# Altium project EMG_MainBoard_Layout.PrjPcb
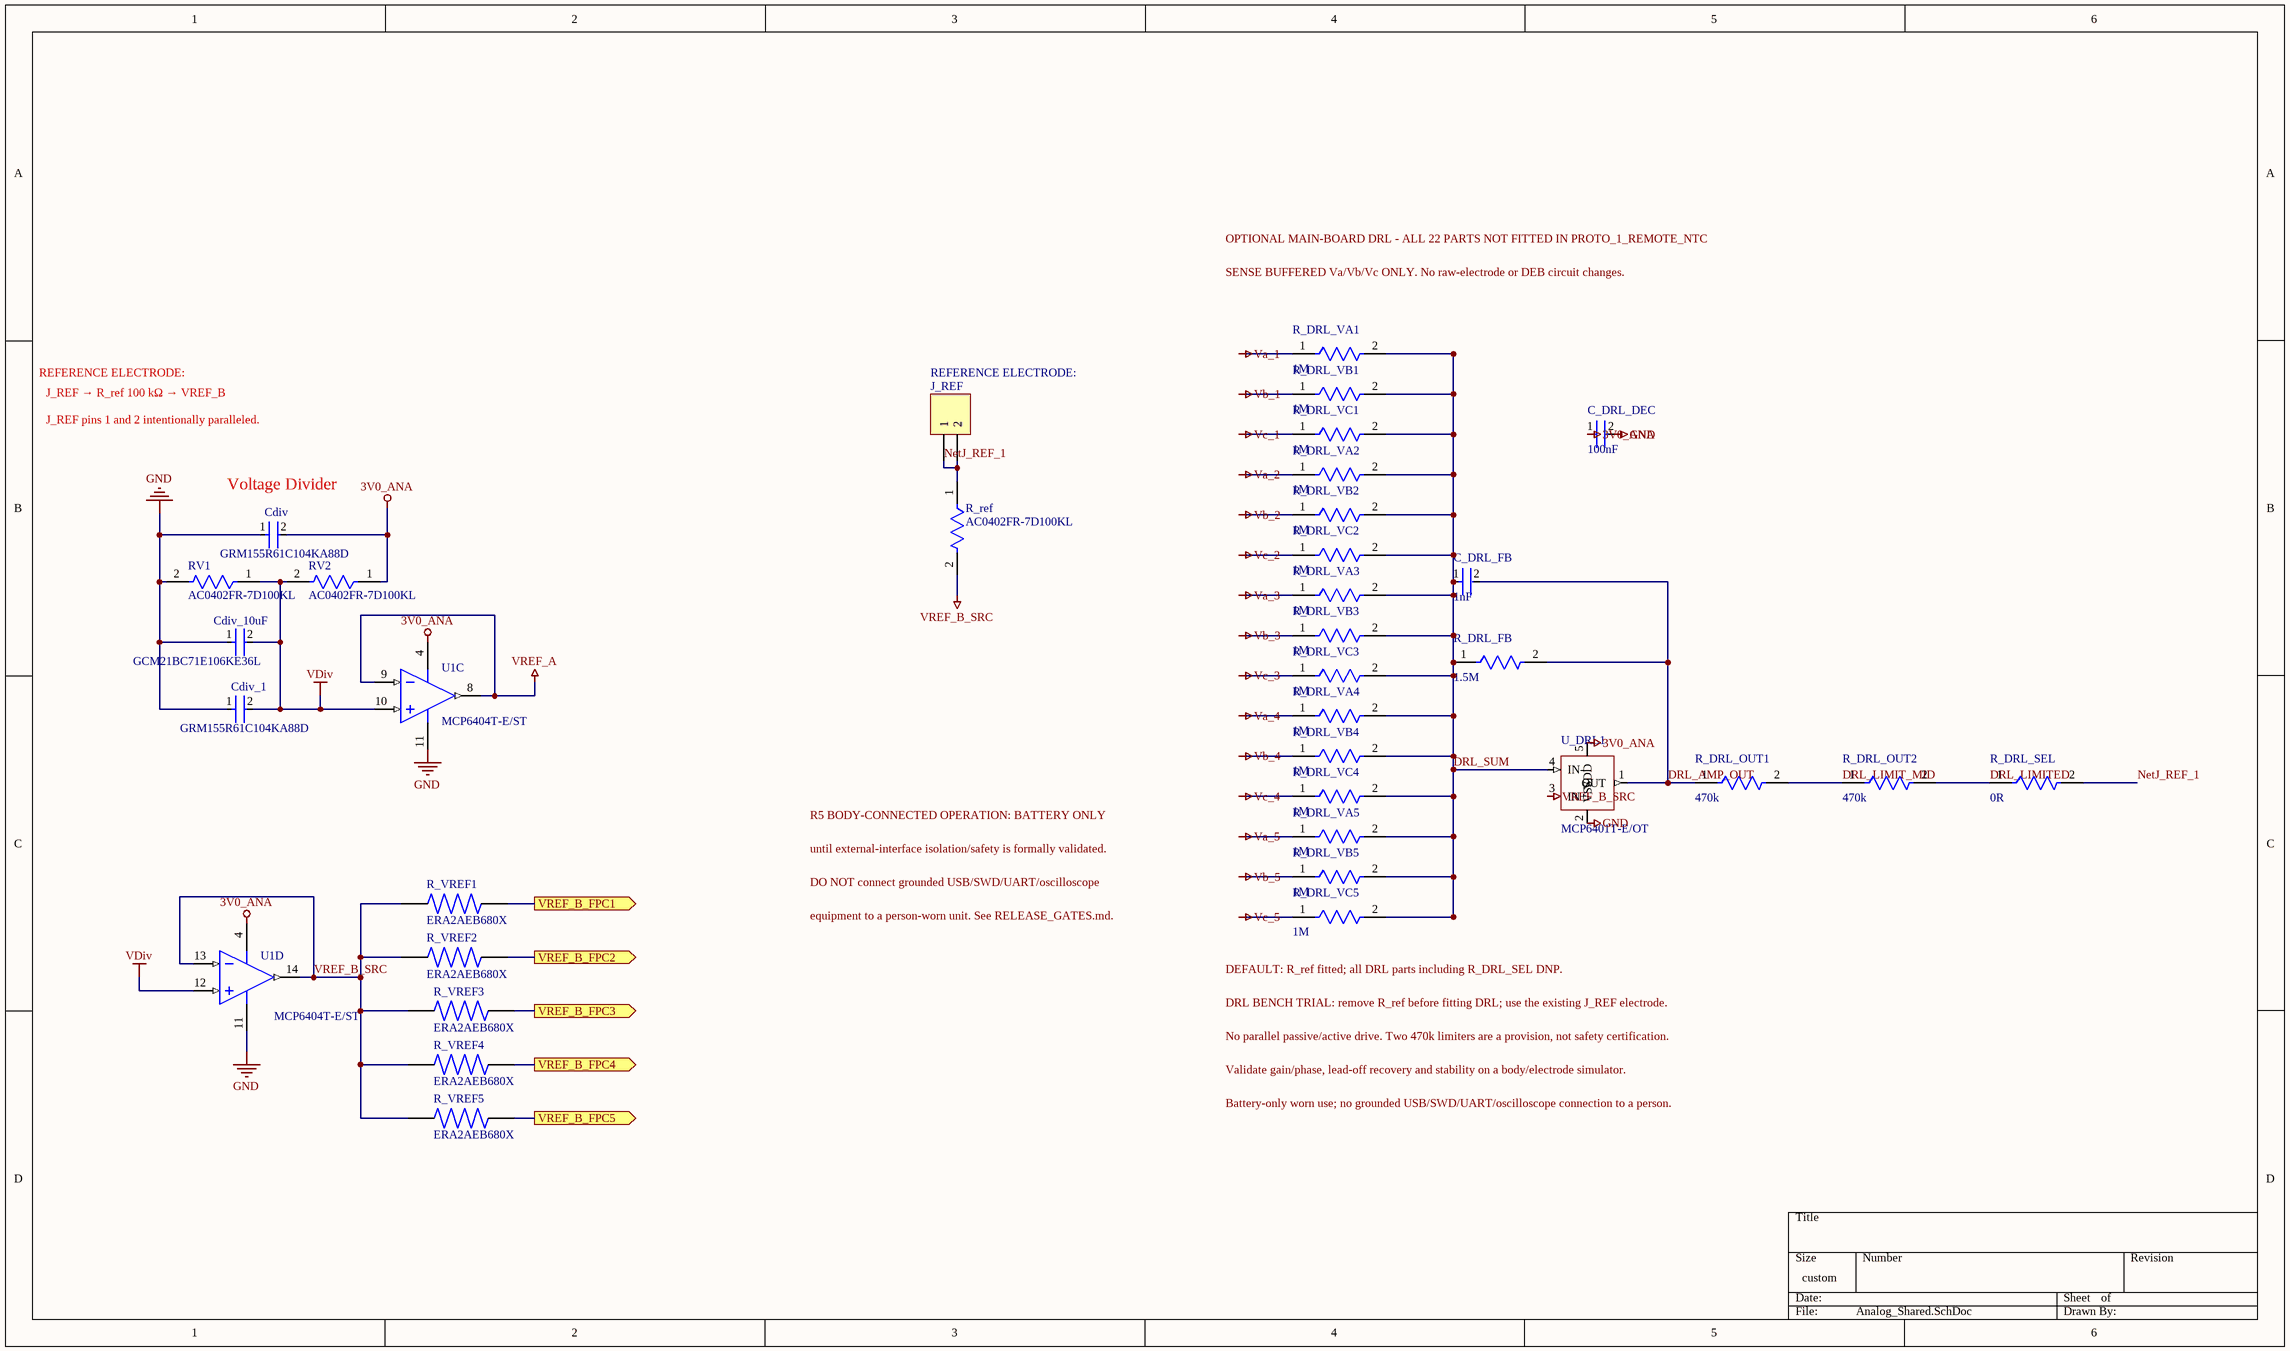
[diagram p0: Analog_Shared.SchDoc]
1 sheet, 35 parts. Net scope: flat (ports and power ports of the same name join across sheets).
Board file: EMG_MainBoard_Layout.PcbDoc

## Sheet Analog_Shared.SchDoc
size 431 x 254 mm; SheetNumber: 6; SheetTotal: 8; SPICEModelCachePDGTSSPD: <root> / <DocumentId>PDGTSSPD</DocumentId> / <CacheFrame Number="0"> / <Model Name="mcp6401" Kind="CKT"> / <Text>.SUBCKT MCP6401 1 2 3 4 5 / *               | | | | | / *               | | | | Output / *               | | | Negative Supply / *               | | Positive Supply / *               | Inverting Input / *               Non-inverting Input / * / ******************************************************************************** / * Software License Agreement                                                   * / *                                                                              * / * The software supplied herewith by Microchip Technology Incorporated (the     * / * 'Company') is intended and supplied to you, the Company's customer, for use  * / * soley and exclusively on Microchip products.                                 * / *                                                                              * / * The software is owned by the Company and/or its supplier, and is protected   * / * under applicable copyright laws. All rights are reserved. Any use in         * / * violation of the foregoing restrictions may subject the user to criminal     * / * sanctions under applicable laws, as well as to civil liability for the       * / * breach of the terms and conditions of this license.                          * / *                                                                              * / * THIS SOFTWARE IS PROVIDED IN AN 'AS IS' CONDITION. NO WARRANTIES, WHETHER    * / * EXPRESS, IMPLIED OR STATUTORY, INCLUDING, BUT NOT LIMITED TO, IMPLIED        * / * WARRANTIES OF MERCHANTABILITY AND FITNESS FOR A PARTICULAR PURPOSE APPLY TO  * / * THIS SOFTWARE. THE COMPANY SHALL NOT, IN ANY CIRCUMSTANCES, BE LIABLE FOR    * / * SPECIAL, INCIDENTAL OR CONSEQUENTIAL DAMAGES, FOR ANY REASON WHATSOEVER.     * / ******************************************************************************** / * / * The following op-amps are covered by this model: / *      MCP6401, MCP6401R, MCP6401U, MCP6402, MCP6404, MCP6406, MCP6407, MCP6409 / * / * / * Revision History: / *      REV A: 10-Oct-10, Created model / *      REV B: 09-Jul-12, Added MCP6406, MCP6407, MCP6409 / * / * Recommendations: / *      Use PSPICE (or SPICE 2G6; other simulators may require translation) / *      For a quick, effective design, use a combination of: data sheet / *            specs, bench testing, and simulations with this macromodel / *      For high impedance circuits, set GMIN=100F in the .OPTIONS statement / * / * Supported: / *      Typical performance for temperature range (-40 to 125) degrees Celsius / *      DC, AC, Transient, and Noise analyses. / *      Most specs, including: offsets, DC PSRR, DC CMRR, input impedance, / *            open loop gain, voltage ranges, supply current, ... , etc. / *      Temperature effects for Ibias, Iquiescent, Iout short circuit / *            current, Vsat on both rails, Slew Rate vs. Temp and P.S. / * / * Not Supported: / *      Some Variation in specs vs. Power Supply Voltage / *      Vos distribution, Ib distribution for Monte Carlo / *      Distortion (detailed non-linear behavior) / *      Some Temperature analysis / *      Process variation / *      Behavior outside normal operating region / * / * / * Input Stage / V10  3 10 -400M / R10 10 11 1.00MEG / R11 10 12 1.00MEG / G10 10 11 10 11 100U / G11 10 12 10 12 100U / C11 11 12 397E-15 / C12  1  0 6P / E12 71 14 POLY(6) 20 0 21 0 22 0 23 0 26 0 27 0   4.5M 11.7 11.7 3.6 3.6 1 1 / G12 1 0 62 0 1m / G13 1 2 63 0 1u / M12 11 14 15 15 NMI / M14 12 2 15 15 NMI / G14 2 0 62 0 1m / C14  2  0 6P / C13 1 2 3P / I15 15 4 20.0U / V16 16 4 -200M / GD16 16 1 TABLE {V(16,1)} ((-100,-1p)(0,0)(1m,1u)(2m,1m)) / V13 3 13 -200M / GD13 2 13 TABLE {V(2,13)} ((-100,-1p)(0,0)(1m,1u)(2m,1m)) / R71  1  0 20.0E12 / R72  2  0 20.0E12 / R73  1  2 20.0E12 / * / * Noise, PSRR, and CMRR / I20 21 20 423U / D20 20  0 DN1 / D21  0 21 DN1 / I22 22 23 1N / R22 22 0  1k / R23  0 23 1k / G26  0 26 POLY(2) 3 0 4 0   0.00 -79.4U -100U / R26 26  0 1 / G27  0 27 POLY(2) 1 0 2 0  -847U 40U 40U / R27 27  0 1 / * / * Open Loop Gain, Slew Rate / G30  0 30 12 11 1 / R30 30  0 1.00K / G31 0 31 3 4 3.9 / I31 0 31 DC 51.5 / R31 31  0 1 TC=3.03M,2.40U / GD31 30 0 TABLE {V(30,31)} ((-100,-1n)(0,0)(1m,0.1)(2m,2)) / CD31 31 30 2p / G32 32 0 3 4 2.2 / I32 32 0 DC 93 / R32 32  0 1 TC=2.22M,-2.72U / GD32 0 30 TABLE {V(30,32)} ((-2m,2)(-1m,0.1)(0,0)(100,-1n)) / CD32 32 30 2p / G33  0 33 30 0 1m / R33  33 0 1K / G34  0 34 33 0 0.325 / R34  34 0 1K / C34  34 0 50.3U / G37  0 37 34 0 1m / R37  37 0 1K / C37  37 0 63.6P / G38  0 38 37 0 1m / R38  39 0 1K / L38  38 39 79.5U / E38  35 0 38 0 1 / G35 33 0 TABLE {V(35,3)} ((-1,-1n)(0,0)(90,1n))(91,1)) / G36 33 0 TABLE {V(35,4)} ((-91,-1)((-90,-1n)(0,0)(1,1n)) / * / * Output Stage / R80 50 0 100MEG / G50 0 50 57 96 2 / R58 57  96 0.50 / R57 57  0 1.2K / C58  5  0 2.00P / G57  0 57 POLY(3) 3 0 4 0 35 0 0 312U 416U 833U / GD55 55 57 TABLE {V(55,57)} ((-2m,-1)(-1m,-1m)(0,0)(10,1n)) / CD55 55 57 2p / CD56 57 56 2p / GD56 57 56 TABLE {V(57,56)} ((-2m,-1)(-1m,-1m)(0,0)(10,1n)) / E55 55  0 POLY(2) 3 0 51 0 2M 1 -54M / E56 56  0 POLY(2) 4 0 52 0 1.2M 1 -50M / R51 51 0 1k / R52 52 0 1k / GD51 50 51 TABLE {V(50,51)} ((-10,-1n)(0,0)(1m,1m)(2m,1)) / GD52 50 52 TABLE {V(50,52)}  ((-2m,-1)(-1m,-1m)(0,0)(10,1n)) / CD51 50 52 2p / CD52 50 51 2p / G53  3  0 POLY(1) 51 0  -20.0U 1M / G54  0  4 POLY(1) 52 0  -20.0U -1M / * / * Current Limit / G99 96 5 99 0 1 / R98 0 98 1 TC=-3.71M,8.17U / G97 0 98 TABLE { V(96,5) } ((-12.0,-7.00M)(-1.00M,-6.93M)(0,0)(1.00M,6.93M)(12.0,7.00M)) / E97 99 0 VALUE { V(98)*((V(3)-V(4))*428M + 142M)} / D98 4 5 DESD / D99 5 3 DESD / * / * Temperature / Voltage Sensitive IQuiscent / R61 0 61 1 TC=2.24M,3.12U / G61 3 4 61 0 1 / G60 0 61 TABLE {V(3,4)} / + ((0,0)(800M,440N)(850M,3.00U)(1.3,40.0U) / + (1.4,42.0U)(5.00,46.0U)(7.00,50.0U)) / * / * Temperature Sensitive offset voltage / I73 0 70 DC 1uA / R74 0 70 1 TC=2.00 / E75 1 71 70 0 1 / * / * Temp Sensistive IBias / I62 0 62 DC 1uA / R62 0 62 REXP  1.1m / * / * Temp Sensistive Offset IBias / I63 0 63 DC 1uA / R63 0 63 1.1 TC=30.4M,454U / * / * Models / .MODEL NMI NMOS(L=2.00U W=50.0U KP=20.0U LEVEL=1 ) / .MODEL DESD  D   N=1 IS=1.00E-15 / .MODEL DN1 D   IS=1P KF=146E-18 AF=1 / .MODEL REXP  RES TCE= 6.6 / .ENDS MCP6401</Text> / </Model> / </CacheFrame> / </root>

### Parts
C_DRL_DEC  100nF  [EMG_DRL_C0402]
C_DRL_FB  1nF  [EMG_DRL_C0402]
Cdiv  GRM155R61C104KA88D  [FP-GRM155-0_05-IPC_C]
Cdiv_1  GRM155R61C104KA88D  [FP-GRM155-0_05-IPC_C]
Cdiv_10uF  GCM21BC71E106KE36L  [FP-GCM21B-0_2-e0_2_0_7-MFG]
J_REF  REFERENCE ELECTRODE:  [HDR1X2]
R_DRL_FB  1.5M  [EMG_DRL_R0603]
R_DRL_OUT1  470k  [EMG_DRL_R0603]
R_DRL_OUT2  470k  [EMG_DRL_R0603]
R_DRL_SEL  0R  [EMG_DRL_R0603]
R_DRL_VA1  1M  [EMG_DRL_R0603]
R_DRL_VA2  1M  [EMG_DRL_R0603]
R_DRL_VA3  1M  [EMG_DRL_R0603]
R_DRL_VA4  1M  [EMG_DRL_R0603]
R_DRL_VA5  1M  [EMG_DRL_R0603]
R_DRL_VB1  1M  [EMG_DRL_R0603]
R_DRL_VB2  1M  [EMG_DRL_R0603]
R_DRL_VB3  1M  [EMG_DRL_R0603]
R_DRL_VB4  1M  [EMG_DRL_R0603]
R_DRL_VB5  1M  [EMG_DRL_R0603]
R_DRL_VC1  1M  [EMG_DRL_R0603]
R_DRL_VC2  1M  [EMG_DRL_R0603]
R_DRL_VC3  1M  [EMG_DRL_R0603]
R_DRL_VC4  1M  [EMG_DRL_R0603]
R_DRL_VC5  1M  [EMG_DRL_R0603]
R_ref  AC0402FR-7D100KL  [FP-AC0402-MFG]
R_VREF1  ERA2AEB680X  [RES_ERA2AEB680X]
R_VREF2  ERA2AEB680X  [RES_ERA2AEB680X]
R_VREF3  ERA2AEB680X  [RES_ERA2AEB680X]
R_VREF4  ERA2AEB680X  [RES_ERA2AEB680X]
R_VREF5  ERA2AEB680X  [RES_ERA2AEB680X]
RV1  AC0402FR-7D100KL  [FP-AC0402-MFG]
RV2  AC0402FR-7D100KL  [FP-AC0402-MFG]
U1  MCP6404T-E/ST  [TSSOP-ST14_N]  (parts C,D of 4)
U_DRL1  MCP6401T-E/OT  [EMG_MCP6401_SOT23_5]

### Ports
VREF_B_FPC1 (out), VREF_B_FPC2 (out), VREF_B_FPC3 (out), VREF_B_FPC4 (out), VREF_B_FPC5 (out)

### Nets
3V0_ANA: C_DRL_DEC.1 Cdiv.2 RV2.1 U1.4(VDD) U_DRL1.5(VDD)
GND: C_DRL_DEC.2 Cdiv.1 Cdiv_1.1 Cdiv_10uF.1 RV1.2 U1.11(VSS) U_DRL1.2(VSS)
Va_1: R_DRL_VA1.1
Va_2: R_DRL_VA2.1
Va_3: R_DRL_VA3.1
Va_4: R_DRL_VA4.1
Va_5: R_DRL_VA5.1
Vb_1: R_DRL_VB1.1
Vb_2: R_DRL_VB2.1
Vb_3: R_DRL_VB3.1
Vb_4: R_DRL_VB4.1
Vb_5: R_DRL_VB5.1
Vc_1: R_DRL_VC1.1
Vc_2: R_DRL_VC2.1
Vc_3: R_DRL_VC3.1
Vc_4: R_DRL_VC4.1
Vc_5: R_DRL_VC5.1
VDiv: Cdiv_1.2 Cdiv_10uF.2 RV1.1 RV2.2 U1.10(VINC+) U1.12(VIND+)
VREF_A: U1.8(VOUTC) U1.9(VINC-)
VREF_B_SRC: R_ref.2 R_VREF1.1 R_VREF2.1 R_VREF3.1 R_VREF4.1 R_VREF5.1 U1.13(VIND-) U1.14(VOUTD) U_DRL1.3(IN+)
DRL_AMP_OUT: C_DRL_FB.2 R_DRL_FB.2 R_DRL_OUT1.1 U_DRL1.1(OUT)
DRL_LIMIT_MID: R_DRL_OUT1.2 R_DRL_OUT2.1
DRL_LIMITED: R_DRL_OUT2.2 R_DRL_SEL.1
DRL_SUM: C_DRL_FB.1 R_DRL_FB.1 R_DRL_VA1.2 R_DRL_VA2.2 R_DRL_VA3.2 R_DRL_VA4.2 R_DRL_VA5.2 R_DRL_VB1.2 R_DRL_VB2.2 R_DRL_VB3.2 R_DRL_VB4.2 R_DRL_VB5.2 R_DRL_VC1.2 R_DRL_VC2.2 R_DRL_VC3.2 R_DRL_VC4.2 R_DRL_VC5.2 U_DRL1.4(IN-)
NetJ_REF_1: J_REF.1 J_REF.2 R_DRL_SEL.2 R_ref.1
NetR_VREF1_2: R_VREF1.2 ; port VREF_B_FPC1
NetR_VREF2_2: R_VREF2.2 ; port VREF_B_FPC2
NetR_VREF3_2: R_VREF3.2 ; port VREF_B_FPC3
NetR_VREF4_2: R_VREF4.2 ; port VREF_B_FPC4
NetR_VREF5_2: R_VREF5.2 ; port VREF_B_FPC5

### Notes on the sheet
- OPTIONAL MAIN-BOARD DRL - ALL 22 PARTS NOT FITTED IN PROTO_1_REMOTE_NTC
- SENSE BUFFERED Va/Vb/Vc ONLY. No raw-electrode or DEB circuit changes.
- REFERENCE ELECTRODE:
- J_REF → R_ref 100 kΩ → VREF_B
- J_REF pins 1 and 2 intentionally paralleled.
- (near Cdiv) Voltage Divider
- R5 BODY-CONNECTED OPERATION: BATTERY ONLY
- until external-interface isolation/safety is formally validated.
- DO NOT connect grounded USB/SWD/UART/oscilloscope
- equipment to a person-worn unit. See RELEASE_GATES.md.
- (near R_DRL_VC5) DEFAULT: R_ref fitted; all DRL parts including R_DRL_SEL DNP.
- DRL BENCH TRIAL: remove R_ref before fitting DRL; use the existing J_REF electrode.
- No parallel passive/active drive. Two 470k limiters are a provision, not safety certification.
- Validate gain/phase, lead-off recovery and stability on a body/electrode simulator.
- Battery-only worn use; no grounded USB/SWD/UART/oscilloscope connection to a person.

### Library data of the parts
C_DRL_DEC = EMG_DRL_C_DRL_DEC: Optional DRL provision; not fitted in PROTO_1_REMOTE_NTC; Manufacturer: Murata Manufacturing; Manufacturer Part Number: GRM155R71C104KA88D; Population: DNP - optional DRL; Assembly Variant: PROTO_1_REMOTE_NTC: Not Fitted; Dielectric: X7R; Tolerance: 10%; Voltage Rating: 16V; Qualification: DNP prototype provision; populated loop and body-interface qualification required; Value: 100nF; Package: 0402 / 1005 metric
C_DRL_FB = EMG_DRL_C_DRL_FB: Optional DRL provision; not fitted in PROTO_1_REMOTE_NTC; Manufacturer: Murata Manufacturing; Manufacturer Part Number: GRM1555C1H102JA01D; Population: DNP - optional DRL; Assembly Variant: PROTO_1_REMOTE_NTC: Not Fitted; Dielectric: C0G / NP0; Tolerance: 5%; Voltage Rating: 50V; Qualification: DNP prototype provision; populated loop and body-interface qualification required; Value: 1nF; Package: 0402 / 1005 metric
Cdiv = EMG_R5_Cdiv: CAP CER 0.1UF 16V X5R 0402; Tolerance: 10%; Capacitance: 100nF; Controlled Revision: R5 2026-09-16; project-local frozen symbol/footprint; Size: 0.5mm; Case Code (Imperial): 0402; Voltage: 16V; REACH SVHC: No SVHC; Packaging: Tape and Reel; Case/Package: 0402; Package Quantity: 1; Max Operating Temperature: 85°C; Voltage Rating (DC): 16V; Min Operating Temperature: -55°C; Construction: Flat; Mount: Surface Mount; Voltage Rating: 16V; Thickness: 0.022inch; Depth: 0.5mm; Termination: SMD/SMT; Length: 1mm; Height: 0.5mm; Series: GRM; Radiation Hardening: No; Width: 0.02inch; RoHS Compliant: Yes; Lead Free: Lead Free; Case Code (Metric): 1005; Dielectric: X5R
Cdiv_1 = EMG_R5_Cdiv_1: CAP CER 0.1UF 16V X5R 0402; Tolerance: 10%; Capacitance: 100nF; Controlled Revision: R5 2026-09-16; project-local frozen symbol/footprint; Size: 0.5mm; Case Code (Imperial): 0402; Voltage: 16V; REACH SVHC: No SVHC; Packaging: Tape and Reel; Case/Package: 0402; Package Quantity: 1; Max Operating Temperature: 85°C; Voltage Rating (DC): 16V; Min Operating Temperature: -55°C; Construction: Flat; Mount: Surface Mount; Voltage Rating: 16V; Thickness: 0.022inch; Depth: 0.5mm; Termination: SMD/SMT; Length: 1mm; Height: 0.5mm; Series: GRM; Radiation Hardening: No; Width: 0.02inch; RoHS Compliant: Yes; Lead Free: Lead Free; Case Code (Metric): 1005; Dielectric: X5R
Cdiv_10uF = EMG_R5_Cdiv_10uF: 10 µF ±10% 25V Ceramic Capacitor X7S 0805 (2012 Metric); Controlled Revision: R5 2026-09-16; project-local frozen symbol/footprint
J_REF = EMG_R5_J_REF: Header, 2-Pin; Controlled Revision: R5 2026-09-16; project-local frozen symbol/footprint; Production Release Blocker: Freeze exact orderable manufacturer/MPN, package/mating/contact definition before production; do not infer from generic symbol.; LatestRevisionDate: 17-Jul-2002; LatestRevisionNote: Re-released for DXP Platform.; Publisher: Altium Limited
R_DRL_FB = EMG_DRL_R_DRL_FB: Optional DRL provision; not fitted in PROTO_1_REMOTE_NTC; Manufacturer: YAGEO; Manufacturer Part Number: RC0603FR-071M5L; Population: DNP - optional DRL; Assembly Variant: PROTO_1_REMOTE_NTC: Not Fitted; Tolerance: 1%; Power Rating: 0.1W at70C (resistors); Voltage Rating: 75V limiting element voltage (non-jumper); Qualification: DNP prototype provision; populated loop and body-interface qualification required; Value: 1.5M; Package: 0603 / 1608 metric
R_DRL_OUT1 = EMG_DRL_R_DRL_OUT1: Optional DRL provision; not fitted in PROTO_1_REMOTE_NTC; Manufacturer: Panasonic Industry; Manufacturer Part Number: ERJ3EKF4703V; Population: DNP - optional DRL; Assembly Variant: PROTO_1_REMOTE_NTC: Not Fitted; Tolerance: 1%; Power Rating: 0.1W at70C (resistors); Voltage Rating: 75V limiting element voltage (non-jumper); Qualification: DNP prototype provision; populated loop and body-interface qualification required; Value: 470k; Package: 0603 / 1608 metric
R_DRL_OUT2 = EMG_DRL_R_DRL_OUT2: Optional DRL provision; not fitted in PROTO_1_REMOTE_NTC; Manufacturer: Panasonic Industry; Manufacturer Part Number: ERJ3EKF4703V; Population: DNP - optional DRL; Assembly Variant: PROTO_1_REMOTE_NTC: Not Fitted; Tolerance: 1%; Power Rating: 0.1W at70C (resistors); Voltage Rating: 75V limiting element voltage (non-jumper); Qualification: DNP prototype provision; populated loop and body-interface qualification required; Value: 470k; Package: 0603 / 1608 metric
R_DRL_SEL = EMG_DRL_R_DRL_SEL: Optional DRL provision; not fitted in PROTO_1_REMOTE_NTC; Manufacturer: Panasonic Industry; Manufacturer Part Number: ERJ3GEY0R00V; Population: DNP - optional DRL; Assembly Variant: PROTO_1_REMOTE_NTC: Not Fitted; Tolerance: Jumper: 50mOhm maximum; Power Rating: 0.1W at70C (resistors); Voltage Rating: 75V limiting element voltage (non-jumper); Qualification: DNP prototype provision; populated loop and body-interface qualification required; Value: 0R; Package: 0603 / 1608 metric
R_DRL_VA1 = EMG_DRL_R_DRL_VA1: Optional DRL provision; not fitted in PROTO_1_REMOTE_NTC; Manufacturer: Panasonic Industry; Manufacturer Part Number: ERJ3EKF1004V; Population: DNP - optional DRL; Assembly Variant: PROTO_1_REMOTE_NTC: Not Fitted; Tolerance: 1%; Power Rating: 0.1W at70C (resistors); Voltage Rating: 75V limiting element voltage (non-jumper); Qualification: DNP prototype provision; populated loop and body-interface qualification required; Value: 1M; Package: 0603 / 1608 metric
R_DRL_VA2 = EMG_DRL_R_DRL_VA2: Optional DRL provision; not fitted in PROTO_1_REMOTE_NTC; Manufacturer: Panasonic Industry; Manufacturer Part Number: ERJ3EKF1004V; Population: DNP - optional DRL; Assembly Variant: PROTO_1_REMOTE_NTC: Not Fitted; Tolerance: 1%; Power Rating: 0.1W at70C (resistors); Voltage Rating: 75V limiting element voltage (non-jumper); Qualification: DNP prototype provision; populated loop and body-interface qualification required; Value: 1M; Package: 0603 / 1608 metric
R_DRL_VA3 = EMG_DRL_R_DRL_VA3: Optional DRL provision; not fitted in PROTO_1_REMOTE_NTC; Manufacturer: Panasonic Industry; Manufacturer Part Number: ERJ3EKF1004V; Population: DNP - optional DRL; Assembly Variant: PROTO_1_REMOTE_NTC: Not Fitted; Tolerance: 1%; Power Rating: 0.1W at70C (resistors); Voltage Rating: 75V limiting element voltage (non-jumper); Qualification: DNP prototype provision; populated loop and body-interface qualification required; Value: 1M; Package: 0603 / 1608 metric
R_DRL_VA4 = EMG_DRL_R_DRL_VA4: Optional DRL provision; not fitted in PROTO_1_REMOTE_NTC; Manufacturer: Panasonic Industry; Manufacturer Part Number: ERJ3EKF1004V; Population: DNP - optional DRL; Assembly Variant: PROTO_1_REMOTE_NTC: Not Fitted; Tolerance: 1%; Power Rating: 0.1W at70C (resistors); Voltage Rating: 75V limiting element voltage (non-jumper); Qualification: DNP prototype provision; populated loop and body-interface qualification required; Value: 1M; Package: 0603 / 1608 metric
R_DRL_VA5 = EMG_DRL_R_DRL_VA5: Optional DRL provision; not fitted in PROTO_1_REMOTE_NTC; Manufacturer: Panasonic Industry; Manufacturer Part Number: ERJ3EKF1004V; Population: DNP - optional DRL; Assembly Variant: PROTO_1_REMOTE_NTC: Not Fitted; Tolerance: 1%; Power Rating: 0.1W at70C (resistors); Voltage Rating: 75V limiting element voltage (non-jumper); Qualification: DNP prototype provision; populated loop and body-interface qualification required; Value: 1M; Package: 0603 / 1608 metric
R_DRL_VB1 = EMG_DRL_R_DRL_VB1: Optional DRL provision; not fitted in PROTO_1_REMOTE_NTC; Manufacturer: Panasonic Industry; Manufacturer Part Number: ERJ3EKF1004V; Population: DNP - optional DRL; Assembly Variant: PROTO_1_REMOTE_NTC: Not Fitted; Tolerance: 1%; Power Rating: 0.1W at70C (resistors); Voltage Rating: 75V limiting element voltage (non-jumper); Qualification: DNP prototype provision; populated loop and body-interface qualification required; Value: 1M; Package: 0603 / 1608 metric
R_DRL_VB2 = EMG_DRL_R_DRL_VB2: Optional DRL provision; not fitted in PROTO_1_REMOTE_NTC; Manufacturer: Panasonic Industry; Manufacturer Part Number: ERJ3EKF1004V; Population: DNP - optional DRL; Assembly Variant: PROTO_1_REMOTE_NTC: Not Fitted; Tolerance: 1%; Power Rating: 0.1W at70C (resistors); Voltage Rating: 75V limiting element voltage (non-jumper); Qualification: DNP prototype provision; populated loop and body-interface qualification required; Value: 1M; Package: 0603 / 1608 metric
R_DRL_VB3 = EMG_DRL_R_DRL_VB3: Optional DRL provision; not fitted in PROTO_1_REMOTE_NTC; Manufacturer: Panasonic Industry; Manufacturer Part Number: ERJ3EKF1004V; Population: DNP - optional DRL; Assembly Variant: PROTO_1_REMOTE_NTC: Not Fitted; Tolerance: 1%; Power Rating: 0.1W at70C (resistors); Voltage Rating: 75V limiting element voltage (non-jumper); Qualification: DNP prototype provision; populated loop and body-interface qualification required; Value: 1M; Package: 0603 / 1608 metric
R_DRL_VB4 = EMG_DRL_R_DRL_VB4: Optional DRL provision; not fitted in PROTO_1_REMOTE_NTC; Manufacturer: Panasonic Industry; Manufacturer Part Number: ERJ3EKF1004V; Population: DNP - optional DRL; Assembly Variant: PROTO_1_REMOTE_NTC: Not Fitted; Tolerance: 1%; Power Rating: 0.1W at70C (resistors); Voltage Rating: 75V limiting element voltage (non-jumper); Qualification: DNP prototype provision; populated loop and body-interface qualification required; Value: 1M; Package: 0603 / 1608 metric
R_DRL_VB5 = EMG_DRL_R_DRL_VB5: Optional DRL provision; not fitted in PROTO_1_REMOTE_NTC; Manufacturer: Panasonic Industry; Manufacturer Part Number: ERJ3EKF1004V; Population: DNP - optional DRL; Assembly Variant: PROTO_1_REMOTE_NTC: Not Fitted; Tolerance: 1%; Power Rating: 0.1W at70C (resistors); Voltage Rating: 75V limiting element voltage (non-jumper); Qualification: DNP prototype provision; populated loop and body-interface qualification required; Value: 1M; Package: 0603 / 1608 metric
R_DRL_VC1 = EMG_DRL_R_DRL_VC1: Optional DRL provision; not fitted in PROTO_1_REMOTE_NTC; Manufacturer: Panasonic Industry; Manufacturer Part Number: ERJ3EKF1004V; Population: DNP - optional DRL; Assembly Variant: PROTO_1_REMOTE_NTC: Not Fitted; Tolerance: 1%; Power Rating: 0.1W at70C (resistors); Voltage Rating: 75V limiting element voltage (non-jumper); Qualification: DNP prototype provision; populated loop and body-interface qualification required; Value: 1M; Package: 0603 / 1608 metric
R_DRL_VC2 = EMG_DRL_R_DRL_VC2: Optional DRL provision; not fitted in PROTO_1_REMOTE_NTC; Manufacturer: Panasonic Industry; Manufacturer Part Number: ERJ3EKF1004V; Population: DNP - optional DRL; Assembly Variant: PROTO_1_REMOTE_NTC: Not Fitted; Tolerance: 1%; Power Rating: 0.1W at70C (resistors); Voltage Rating: 75V limiting element voltage (non-jumper); Qualification: DNP prototype provision; populated loop and body-interface qualification required; Value: 1M; Package: 0603 / 1608 metric
R_DRL_VC3 = EMG_DRL_R_DRL_VC3: Optional DRL provision; not fitted in PROTO_1_REMOTE_NTC; Manufacturer: Panasonic Industry; Manufacturer Part Number: ERJ3EKF1004V; Population: DNP - optional DRL; Assembly Variant: PROTO_1_REMOTE_NTC: Not Fitted; Tolerance: 1%; Power Rating: 0.1W at70C (resistors); Voltage Rating: 75V limiting element voltage (non-jumper); Qualification: DNP prototype provision; populated loop and body-interface qualification required; Value: 1M; Package: 0603 / 1608 metric
R_DRL_VC4 = EMG_DRL_R_DRL_VC4: Optional DRL provision; not fitted in PROTO_1_REMOTE_NTC; Manufacturer: Panasonic Industry; Manufacturer Part Number: ERJ3EKF1004V; Population: DNP - optional DRL; Assembly Variant: PROTO_1_REMOTE_NTC: Not Fitted; Tolerance: 1%; Power Rating: 0.1W at70C (resistors); Voltage Rating: 75V limiting element voltage (non-jumper); Qualification: DNP prototype provision; populated loop and body-interface qualification required; Value: 1M; Package: 0603 / 1608 metric
R_DRL_VC5 = EMG_DRL_R_DRL_VC5: Optional DRL provision; not fitted in PROTO_1_REMOTE_NTC; Manufacturer: Panasonic Industry; Manufacturer Part Number: ERJ3EKF1004V; Population: DNP - optional DRL; Assembly Variant: PROTO_1_REMOTE_NTC: Not Fitted; Tolerance: 1%; Power Rating: 0.1W at70C (resistors); Voltage Rating: 75V limiting element voltage (non-jumper); Qualification: DNP prototype provision; populated loop and body-interface qualification required; Value: 1M; Package: 0603 / 1608 metric
R_ref = EMG_R5_R_ref: AC0402 100KΩ 0.0625W 1.00%; Manufacturer: Yageo; Automotive Grade: Grade 0; Voltage Rating: 50V; Tolerance: 0.01; Controlled Revision: R5 2026-09-16; project-local frozen symbol/footprint; Resistance: 100KΩ; Automotive: Yes; Device Class L1: Passive Components; Temperature Range High: +155°C; ComponentLink2URL: http://www.yageo.com/documents/recent/PYu-AC_51_RoHS_L_6.pdf; Footprint Url: http://www.yageo.com/exep/pages/download/literatures/PYu-R_Mount_10.pdf; Power Rating: 0.0625W; RoHS: TRUE; Category: Res; Package: AC0402; Octopart: https://octopart.com/ac0402fr-7d100kl-yageo-91024821; Device Class L2: Resistors; Series: AC; Height: 0.37mm; ComponentLink2Description: Datasheet; Lead Free: Yes; Temperature Range Low: -55°C; Value: 100KΩ; Temperature: -55°C to +155°C; Ipc Land Pattern Name: RESC10050X32; Device Class L3: Chip SMD Resistors; Manufacturer Part Number: AC0402FR-7D100KL; Composition: Thick Film
R_VREF1 = EMG_R5_R_VREF1: Controlled Revision: R5 2026-09-16; project-local frozen symbol/footprint; Value: *; Package: None; MP: ERA2AEB680X; Price: None; Availability: Unavailable
R_VREF2 = EMG_R5_R_VREF2: Controlled Revision: R5 2026-09-16; project-local frozen symbol/footprint; Value: *; Package: None; MP: ERA2AEB680X; Price: None; Availability: Unavailable
R_VREF3 = EMG_R5_R_VREF3: Controlled Revision: R5 2026-09-16; project-local frozen symbol/footprint; Value: *; Package: None; MP: ERA2AEB680X; Price: None; Availability: Unavailable
R_VREF4 = EMG_R5_R_VREF4: Controlled Revision: R5 2026-09-16; project-local frozen symbol/footprint; Value: *; Package: None; MP: ERA2AEB680X; Price: None; Availability: Unavailable
R_VREF5 = EMG_R5_R_VREF5: Controlled Revision: R5 2026-09-16; project-local frozen symbol/footprint; Value: *; Package: None; MP: ERA2AEB680X; Price: None; Availability: Unavailable
RV1 = EMG_R5_RV1: AC0402 100KΩ 0.0625W 1.00%; Manufacturer: Yageo; Automotive Grade: Grade 0; Voltage Rating: 50V; Tolerance: 0.01; Controlled Revision: R5 2026-09-16; project-local frozen symbol/footprint; Resistance: 100KΩ; Automotive: Yes; Device Class L1: Passive Components; Temperature Range High: +155°C; ComponentLink2URL: http://www.yageo.com/documents/recent/PYu-AC_51_RoHS_L_6.pdf; Footprint Url: http://www.yageo.com/exep/pages/download/literatures/PYu-R_Mount_10.pdf; Power Rating: 0.0625W; RoHS: TRUE; Category: Res; Package: AC0402; Octopart: https://octopart.com/ac0402fr-7d100kl-yageo-91024821; Device Class L2: Resistors; Series: AC; Height: 0.37mm; ComponentLink2Description: Datasheet; Lead Free: Yes; Temperature Range Low: -55°C; Value: 100KΩ; Temperature: -55°C to +155°C; Ipc Land Pattern Name: RESC10050X32; Device Class L3: Chip SMD Resistors; Manufacturer Part Number: AC0402FR-7D100KL; Composition: Thick Film
RV2 = EMG_R5_RV2: AC0402 100KΩ 0.0625W 1.00%; Manufacturer: Yageo; Automotive Grade: Grade 0; Voltage Rating: 50V; Tolerance: 0.01; Controlled Revision: R5 2026-09-16; project-local frozen symbol/footprint; Resistance: 100KΩ; Automotive: Yes; Device Class L1: Passive Components; Temperature Range High: +155°C; ComponentLink2URL: http://www.yageo.com/documents/recent/PYu-AC_51_RoHS_L_6.pdf; Footprint Url: http://www.yageo.com/exep/pages/download/literatures/PYu-R_Mount_10.pdf; Power Rating: 0.0625W; RoHS: TRUE; Category: Res; Package: AC0402; Octopart: https://octopart.com/ac0402fr-7d100kl-yageo-91024821; Device Class L2: Resistors; Series: AC; Height: 0.37mm; ComponentLink2Description: Datasheet; Lead Free: Yes; Temperature Range Low: -55°C; Value: 100KΩ; Temperature: -55°C to +155°C; Ipc Land Pattern Name: RESC10050X32; Device Class L3: Chip SMD Resistors; Manufacturer Part Number: AC0402FR-7D100KL; Composition: Thick Film
U1 = EMG_R5_U1: None; Nominal Supply Current: 45uA; Power Supply Rejection Ratio (PSRR): 63dB; Unity Gain Bandwidth Product: 1MHz; Amplifier Type: GENERAL PURPOSE; Voltage Gain: 110dB; Number of Channels: 4; Output Current: 15mA; Max Supply Voltage: 6V; Min Supply Voltage: 1.8V; Slew Rate: 0.5V/µs; Input Bias Current: 100pA; Input Offset Voltage (Vos): 4.5mV; Common Mode Rejection Ratio: 56dB; Controlled Revision: R5 2026-09-16; project-local frozen symbol/footprint; Number of Pins: 14; Case/Package: TSSOP; Packaging: Tape and Reel; Technology: CMOS; Lead Free: Lead Free; Max Operating Temperature: 125°C; Mount: Surface Mount; Number of Circuits: 4; Number of Elements: 4; Supply Current: 45uA; RoHS Compliant: Yes; Gain Bandwidth Product: 1MHz; Min Operating Temperature: -40°C
U_DRL1 = EMG_MCP6401_SOT23_5_DRL: MCP6401 single operational amplifier, SOT-23-5; optional DRL, DNP; Manufacturer: Microchip Technology; Population: DNP - optional DRL; Assembly Variant: PROTO_1_REMOTE_NTC: Not Fitted; Manufacturer Part Number: MCP6401T-E/OT; Package: SOT-23-5 / OT

## Assembly variants
PROTO_1: not fitted C_WIFI_BULK C_WIFI_X32_IN C_WIFI_X32_OUT R_TH_BAT
PROTO_1_REMOTE_NTC: not fitted C_DRL_DEC C_DRL_FB C_WIFI_BULK C_WIFI_X32_IN C_WIFI_X32_OUT R_DRL_FB R_DRL_OUT1 R_DRL_OUT2 R_DRL_SEL R_DRL_VA1 R_DRL_VA2 R_DRL_VA3 R_DRL_VA4 R_DRL_VA5 R_DRL_VB1 R_DRL_VB2 R_DRL_VB3 R_DRL_VB4 R_DRL_VB5 R_DRL_VC1 R_DRL_VC2 R_DRL_VC3 R_DRL_VC4 R_DRL_VC5 U_DRL1